# Altium project STM8S003F3P6_Board_Ver1.PrjPcb
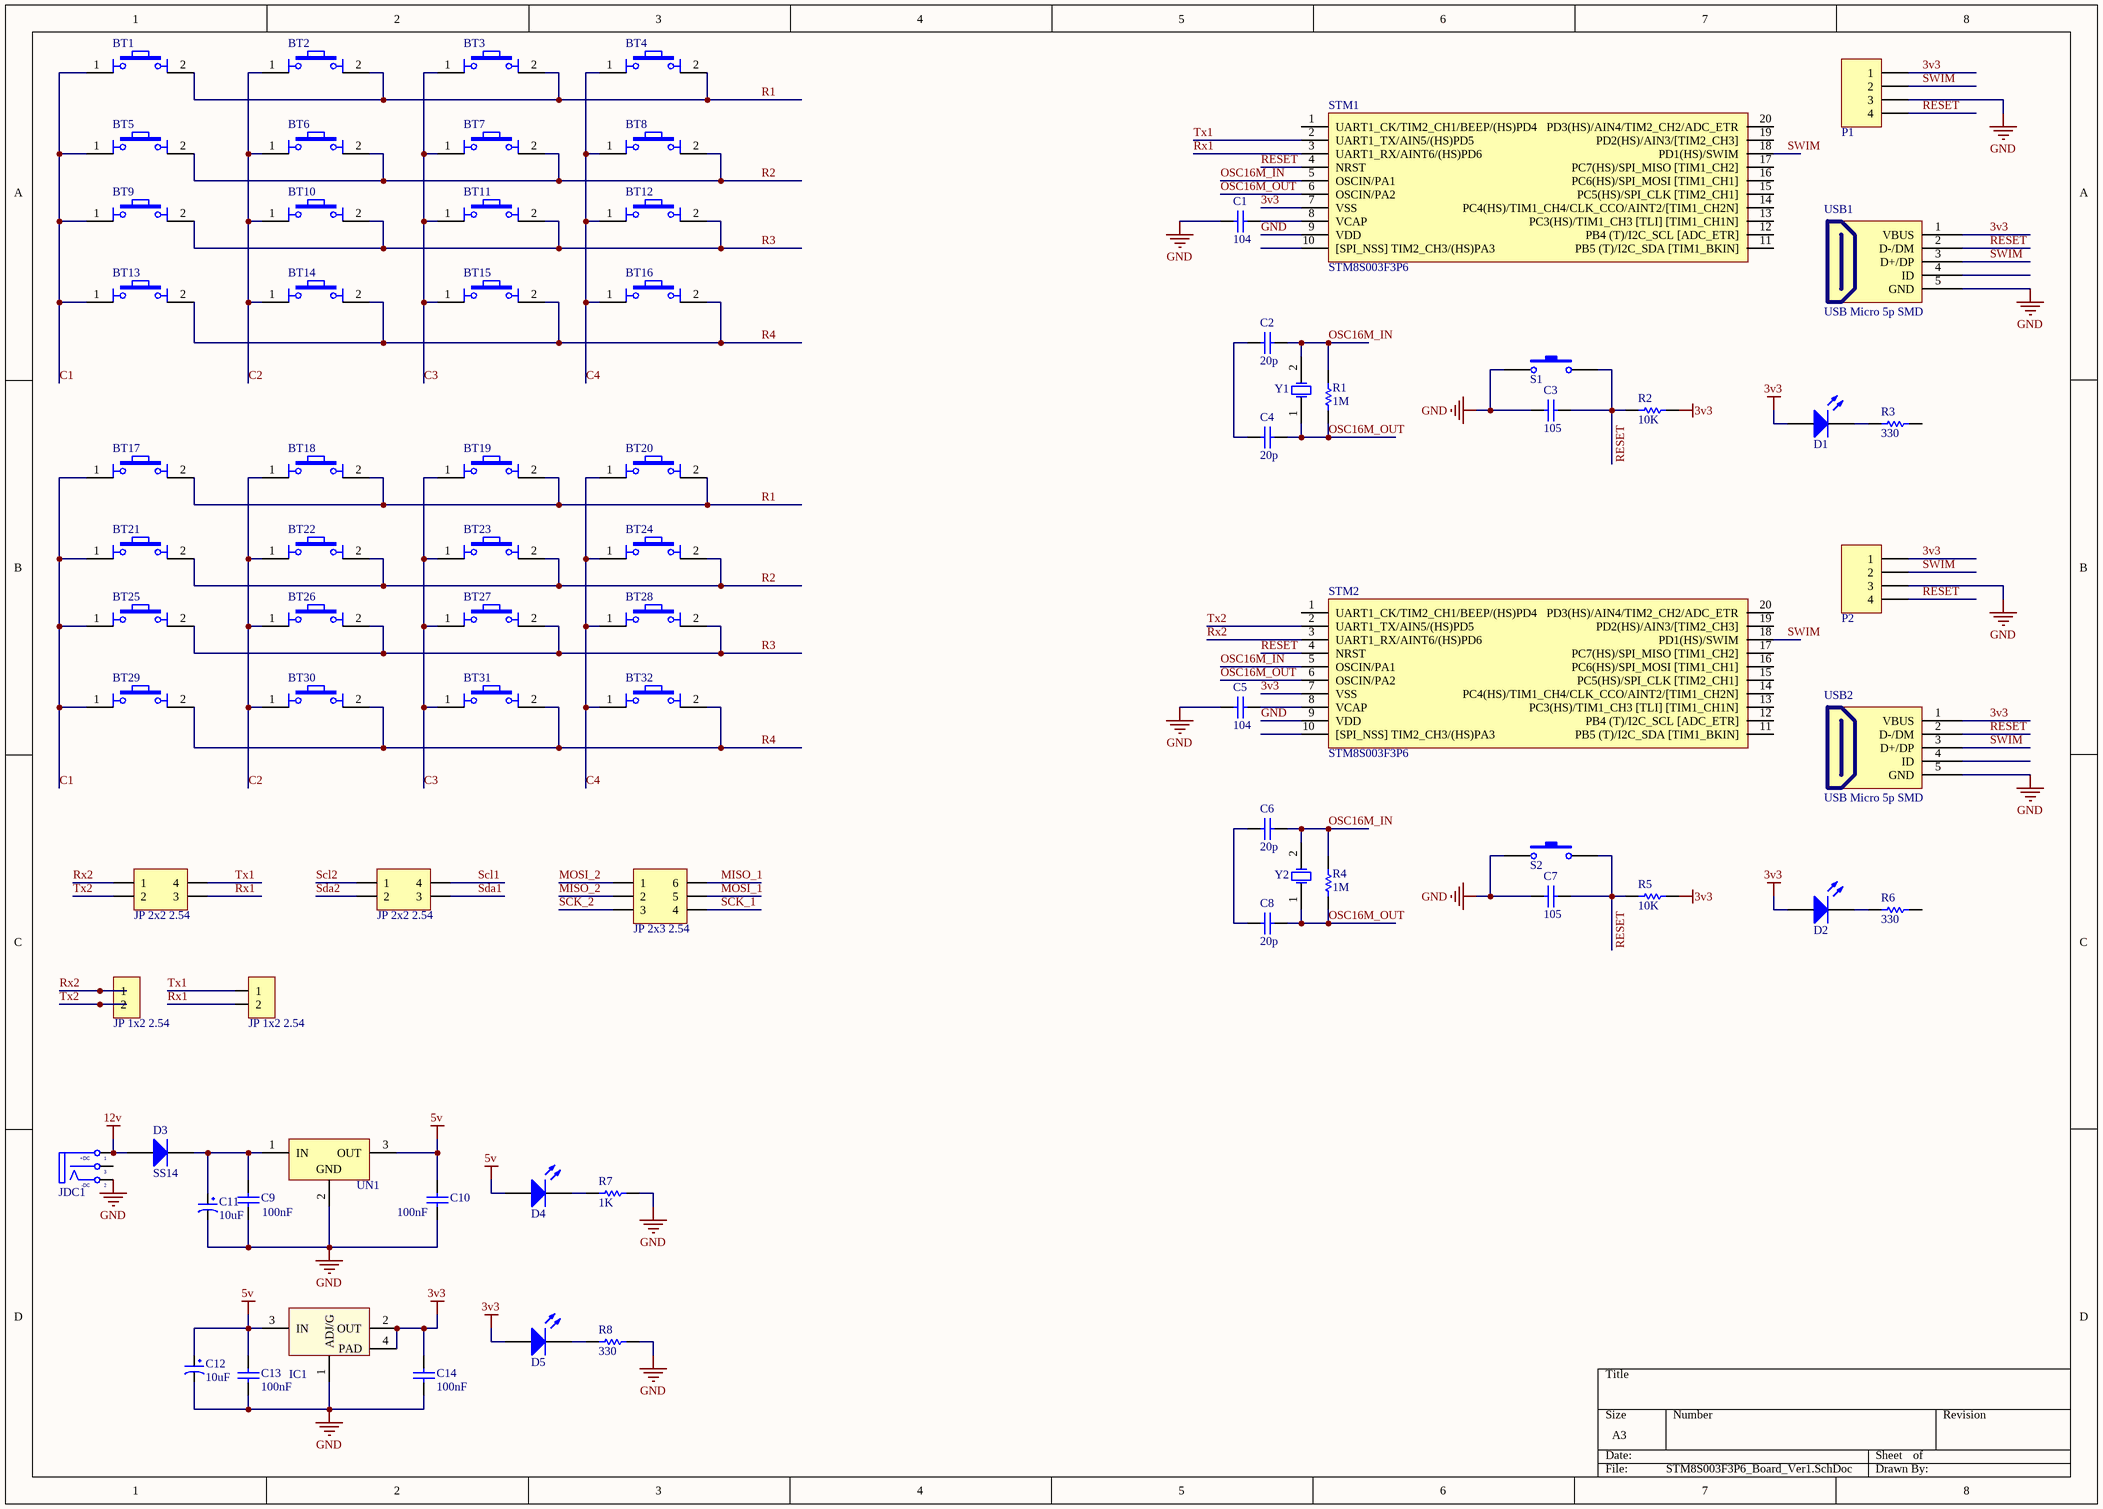
[diagram p0: STM8S003F3P6_Board_Ver1.SchDoc]
1 sheet, 77 parts. Net scope: global (net labels, ports and power ports of the same name join across sheets).
Board file: STM8S003F3P6_Board_Ver1.PcbDoc

## Sheet STM8S003F3P6_Board_Ver1.SchDoc
size A3; SheetNumber: 1; SheetTotal: 1

### Parts
BT1  Nut Nhan 4 Chan Cam 6x6  [Nut Nhan 4 Chan Cam 6x6]  (value not drawn)
BT2  Nut Nhan 4 Chan Cam 6x6  [Nut Nhan 4 Chan Cam 6x6]  (value not drawn)
BT3  Nut Nhan 4 Chan Cam 6x6  [Nut Nhan 4 Chan Cam 6x6]  (value not drawn)
BT4  Nut Nhan 4 Chan Cam 6x6  [Nut Nhan 4 Chan Cam 6x6]  (value not drawn)
BT5  Nut Nhan 4 Chan Cam 6x6  [Nut Nhan 4 Chan Cam 6x6]  (value not drawn)
BT6  Nut Nhan 4 Chan Cam 6x6  [Nut Nhan 4 Chan Cam 6x6]  (value not drawn)
BT7  Nut Nhan 4 Chan Cam 6x6  [Nut Nhan 4 Chan Cam 6x6]  (value not drawn)
BT8  Nut Nhan 4 Chan Cam 6x6  [Nut Nhan 4 Chan Cam 6x6]  (value not drawn)
BT9  Nut Nhan 4 Chan Cam 6x6  [Nut Nhan 4 Chan Cam 6x6]  (value not drawn)
BT10  Nut Nhan 4 Chan Cam 6x6  [Nut Nhan 4 Chan Cam 6x6]  (value not drawn)
BT11  Nut Nhan 4 Chan Cam 6x6  [Nut Nhan 4 Chan Cam 6x6]  (value not drawn)
BT12  Nut Nhan 4 Chan Cam 6x6  [Nut Nhan 4 Chan Cam 6x6]  (value not drawn)
BT13  Nut Nhan 4 Chan Cam 6x6  [Nut Nhan 4 Chan Cam 6x6]  (value not drawn)
BT14  Nut Nhan 4 Chan Cam 6x6  [Nut Nhan 4 Chan Cam 6x6]  (value not drawn)
BT15  Nut Nhan 4 Chan Cam 6x6  [Nut Nhan 4 Chan Cam 6x6]  (value not drawn)
BT16  Nut Nhan 4 Chan Cam 6x6  [Nut Nhan 4 Chan Cam 6x6]  (value not drawn)
BT17  Nut Nhan 4 Chan Cam 6x6  [Nut Nhan 4 Chan Cam 6x6]  (value not drawn)
BT18  Nut Nhan 4 Chan Cam 6x6  [Nut Nhan 4 Chan Cam 6x6]  (value not drawn)
BT19  Nut Nhan 4 Chan Cam 6x6  [Nut Nhan 4 Chan Cam 6x6]  (value not drawn)
BT20  Nut Nhan 4 Chan Cam 6x6  [Nut Nhan 4 Chan Cam 6x6]  (value not drawn)
BT21  Nut Nhan 4 Chan Cam 6x6  [Nut Nhan 4 Chan Cam 6x6]  (value not drawn)
BT22  Nut Nhan 4 Chan Cam 6x6  [Nut Nhan 4 Chan Cam 6x6]  (value not drawn)
BT23  Nut Nhan 4 Chan Cam 6x6  [Nut Nhan 4 Chan Cam 6x6]  (value not drawn)
BT24  Nut Nhan 4 Chan Cam 6x6  [Nut Nhan 4 Chan Cam 6x6]  (value not drawn)
BT25  Nut Nhan 4 Chan Cam 6x6  [Nut Nhan 4 Chan Cam 6x6]  (value not drawn)
BT26  Nut Nhan 4 Chan Cam 6x6  [Nut Nhan 4 Chan Cam 6x6]  (value not drawn)
BT27  Nut Nhan 4 Chan Cam 6x6  [Nut Nhan 4 Chan Cam 6x6]  (value not drawn)
BT28  Nut Nhan 4 Chan Cam 6x6  [Nut Nhan 4 Chan Cam 6x6]  (value not drawn)
BT29  Nut Nhan 4 Chan Cam 6x6  [Nut Nhan 4 Chan Cam 6x6]  (value not drawn)
BT30  Nut Nhan 4 Chan Cam 6x6  [Nut Nhan 4 Chan Cam 6x6]  (value not drawn)
BT31  Nut Nhan 4 Chan Cam 6x6  [Nut Nhan 4 Chan Cam 6x6]  (value not drawn)
BT32  Nut Nhan 4 Chan Cam 6x6  [Nut Nhan 4 Chan Cam 6x6]  (value not drawn)
C1  104  [tu 0805]
C2  value 20p  [CAP-SM-0805]  (hidden comment: Cap Non-Pol SMD)
C3  value 105  [CAP-SM-0805]  (hidden comment: Cap Non-Pol SMD)
C4  value 20p  [CAP-SM-0805]  (hidden comment: Cap Non-Pol SMD)
C5  104  [tu 0805]
C6  value 20p  [CAP-SM-0805]  (hidden comment: Cap Non-Pol SMD)
C7  value 105  [CAP-SM-0805]  (hidden comment: Cap Non-Pol SMD)
C8  value 20p  [CAP-SM-0805]  (hidden comment: Cap Non-Pol SMD)
C9  value 100nF  [CAP-SM-0805]  (hidden comment: Cap Non-Pol SMD)
C10  value 100nF  [CAP-SM-0805]  (hidden comment: Cap Non-Pol SMD)
C11  10uF  [tu tantalum smd3216]
C12  10uF  [tu tantalum smd3216]
C13  value 100nF  [CAP-SM-0805]  (hidden comment: Cap Non-Pol SMD)
C14  value 100nF  [CAP-SM-0805]  (hidden comment: Cap Non-Pol SMD)
D1  LED SMD  [LED_0805_Blue]  (value not drawn)
D2  LED SMD  [LED_0805_Blue]  (value not drawn)
D3  SS14  [DIODE SMA]
D4  LED SMD  [LED_0805_Blue]  (value not drawn)
D5  LED SMD  [LED_0805_Blue]  (value not drawn)
IC1  LM1117  [SOT223-4N]  (value not drawn)
JDC1  Jack DC  [DC-IN]  (value not drawn)
JP1  JP 2x3 2.54  [JP 2x3 DT]
JP2  JP 2x2 2.54  [JP 2x2 DT]
JP3  JP 2x2 2.54  [JP 2x2 DT]
JP4  JP 1x2 2.54  [JP 1x2 DT]
JP5  JP 1x2 2.54  [JP 1x2 DT]
P1  Header 4  [JP4]  (value not drawn)
P2  Header 4  [JP4]  (value not drawn)
R1  value 1M  [RES-SM-0805]  (hidden comment: RESISTOR SMD)
R2  value 10K  [RES-SM-0805]  (hidden comment: RESISTOR SMD)
R3  value 330  [RES-SM-0805]  (hidden comment: RESISTOR SMD)
R4  value 1M  [RES-SM-0805]  (hidden comment: RESISTOR SMD)
R5  value 10K  [RES-SM-0805]  (hidden comment: RESISTOR SMD)
R6  value 330  [RES-SM-0805]  (hidden comment: RESISTOR SMD)
R7  value 1K  [RES-SM-0805]  (hidden comment: RESISTOR SMD)
R8  value 330  [RES-SM-0805]  (hidden comment: RESISTOR SMD)
S1  Tact SW - 2Pin  [SW-SMD]  (value not drawn)
S2  Tact SW - 2Pin  [SW-SMD]  (value not drawn)
STM1  STM8S003F3P6  [TSSOP20]
STM2  STM8S003F3P6  [TSSOP20]
UN1  LM7805  [QTO-220]  (value not drawn)
USB1  USB Micro 5p SMD  [USB Micro 5p SMD]
USB2  USB Micro 5p SMD  [USB Micro 5p SMD]
Y1  XTAL  [XT2]  (value not drawn)
Y2  XTAL  [XT2]  (value not drawn)

### Nets
3v3: C14.2 D1.1(A) D2.1(A) D5.1(A) IC1.2(OUT) IC1.4(PAD) P1.1 P2.1 R2.2 R5.2 STM1.7(VSS) STM2.7(VSS) USB1.1(VBUS) USB2.1(VBUS)
5v: C10.2 C12.1 C13.2 D4.1(A) IC1.3(IN) UN1.3(OUT)
12v: D3.1(A) JDC1.1(T)
GND: C1.2 C3.1 C5.2 C7.1 C9.1 C10.1 C11.2 C12.2 C13.1 C14.1 IC1.1(ADJ/G) JDC1.2(TN) P1.3 P2.3 R7.2 R8.2 S1.1 S2.1 STM1.9(VDD) STM2.9(VDD) UN1.2(GND) USB1.5(GND) USB2.5(GND)
C1: BT1.1 BT5.1 BT9.1 BT13.1 BT17.1 BT21.1 BT25.1 BT29.1
C2: BT2.1 BT6.1 BT10.1 BT14.1 BT18.1 BT22.1 BT26.1 BT30.1
C3: BT3.1 BT7.1 BT11.1 BT15.1 BT19.1 BT23.1 BT27.1 BT31.1
C4: BT4.1 BT8.1 BT12.1 BT16.1 BT20.1 BT24.1 BT28.1 BT32.1
MISO_1: JP1.6
MISO_2: JP1.2
MOSI_1: JP1.5
MOSI_2: JP1.1
OSC16M_IN: C2.2 C6.2 R1.2 R4.2 STM1.5(OSCIN/PA1) STM2.5(OSCIN/PA1) Y1.2(OSC2) Y2.2(OSC2)
OSC16M_OUT: C4.2 C8.2 R1.1 R4.1 STM1.6(OSCIN/PA2) STM2.6(OSCIN/PA2) Y1.1(OSC1) Y2.1(OSC1)
R1: BT1.2 BT2.2 BT3.2 BT4.2 BT17.2 BT18.2 BT19.2 BT20.2
R2: BT5.2 BT6.2 BT7.2 BT8.2 BT21.2 BT22.2 BT23.2 BT24.2
R3: BT9.2 BT10.2 BT11.2 BT12.2 BT25.2 BT26.2 BT27.2 BT28.2
R4: BT13.2 BT14.2 BT15.2 BT16.2 BT29.2 BT30.2 BT31.2 BT32.2
RESET: C3.2 C7.2 P1.4 P2.4 R2.1 R5.1 S1.2 S2.2 STM1.4(NRST) STM2.4(NRST) USB1.2(D-/DM) USB2.2(D-/DM)
Rx1: JP2.3 JP5.2 STM1.3(UART1_RX/AINT6/(HS)PD6)
Rx2: JP2.1 JP4.1 STM2.3(UART1_RX/AINT6/(HS)PD6)
SCK_1: JP1.4
SCK_2: JP1.3
Scl1: JP3.4
Scl2: JP3.1
Sda1: JP3.3
Sda2: JP3.2
SWIM: P1.2 P2.2 STM1.18(PD1(HS)/SWIM) STM2.18(PD1(HS)/SWIM) USB1.3(D+/DP) USB2.3(D+/DP)
Tx1: JP2.4 JP5.1 STM1.2(UART1_TX/AIN5/(HS)PD5)
Tx2: JP2.2 JP4.2 STM2.2(UART1_TX/AIN5/(HS)PD5)
NetC1_1: C1.1 STM1.8(VCAP)
NetC2_1: C2.1 C4.1
NetC5_1: C5.1 STM2.8(VCAP)
NetC6_1: C6.1 C8.1
NetC9_2: C9.2 C11.1 D3.2(K) UN1.1(IN)
NetD1_2: D1.2(K) R3.1
NetD2_2: D2.2(K) R6.1
NetD4_2: D4.2(K) R7.1
NetD5_2: D5.2(K) R8.1

Not connected (* = marked no-connect by the designer): JDC1 3(S); R3 2; R6 2; STM1 1(UART1_CK/TIM2_CH1/BEEP/(HS)PD4) 10([SPI_NSS]_TIM2_CH3/(HS)PA3) 11(PB5_(T)/I2C_SDA_[TIM1_BKIN]) 12(PB4_(T)/I2C_SCL_[ADC_ETR]) 13(PC3(HS)/TIM1_CH3_[TLI]_[TIM1_CH1N]) 14(PC4(HS)/TIM1_CH4/CLK_CCO/AINT2/[TIM1_CH2N]) 15(PC5(HS)/SPI_CLK_[TIM2_CH1]) 16(PC6(HS)/SPI_MOSI_[TIM1_CH1]) 17(PC7(HS)/SPI_MISO_[TIM1_CH2]) 19(PD2(HS)/AIN3/[TIM2_CH3]) 20(PD3(HS)/AIN4/TIM2_CH2/ADC_ETR); STM2 1(UART1_CK/TIM2_CH1/BEEP/(HS)PD4) 10([SPI_NSS]_TIM2_CH3/(HS)PA3) 11(PB5_(T)/I2C_SDA_[TIM1_BKIN]) 12(PB4_(T)/I2C_SCL_[ADC_ETR]) 13(PC3(HS)/TIM1_CH3_[TLI]_[TIM1_CH1N]) 14(PC4(HS)/TIM1_CH4/CLK_CCO/AINT2/[TIM1_CH2N]) 15(PC5(HS)/SPI_CLK_[TIM2_CH1]) 16(PC6(HS)/SPI_MOSI_[TIM1_CH1]) 17(PC7(HS)/SPI_MISO_[TIM1_CH2]) 19(PD2(HS)/AIN3/[TIM2_CH3]) 20(PD3(HS)/AIN4/TIM2_CH2/ADC_ETR); USB1 4(ID); USB2 4(ID)

### Notes on the sheet
- (in symbol Jack DC) +DC; -DC

### Library data of the parts
BT1-BT32 = Nut Nhan 4 Chan Cam 6x6: Nut Nhan 4 Chan 6x6mm; Ten: Nút Nhấn 4 Chân 6x6x5MM DIP; Ma_Hang: MH004584
C1 C5 = Tu 0805 104 50V 10%: Dán; Don_Vi: Con; So_Chan: 2; Ten_Linh_Kien: Tụ 0805 104-100nF 10% 50V; Ma_Hang: MH004551; Chung_Loai: Dán; Kieu_Chan: *
C2-C4 C6-C10 C13 C14 = Cap Non-Pol SMD: Capacitor
C11 C12 = Tu tantalum 10uF 16V SMD3216: Dán; Don_Vi: Con; So_Chan: 2; Ten_Linh_Kien: Tụ tantalum 106C-10uF 16V SMD3216; Ma_Hang: MH001954; Chung_Loai: Dán; Kieu_Chan: *
D1 D2 D4 D5 = LED SMD: LED
D3 = Diode SS14 ( 1N5819): Dán; Ma_Hang: MH002211; Don_Vi: Con; Ten_Linh_Kien: Diode SS14 DO214 Schottky 1A 40V ( 1N5819 DO214); Chung_Loai: Dán; Ghi_Chu: *; Kieu_Chan: *
IC1 = LM1117: Available in 1.8V, 2.5V, 2.85V, 3.3V, 5V, and  Adjustable Versions; Value: LM317
JDC1 = Jack DC: Jack DC input; Value: Jac DC
JP1 = JP 2x3 2.54 Duc Thang: Cắm; Ten_Linh_Kien: Jump Đôi Đực 2.54MM 2x40P Thẳng 11MM; Don_Vi: Con; Ma_Hang: MH002686; Ghi_Chu: *; Kieu_Chan: *; Chung_Loai: Cắm
JP2 JP3 = JP 2x2 2.54 Duc Thang: Cắm; Ten_Linh_Kien: Jump Đôi Đực 2.54MM 2x40P Thẳng 11MM; Don_Vi: Con; Ma_Hang: MH002686; Ghi_Chu: *; Kieu_Chan: *; Chung_Loai: Cắm
JP4 JP5 = JP 1x2 2.54 Duc Thang: Cắm; Ten_Linh_Kien: Jump Đơn Đực 2.54MM 1x40P Thẳng 11MM; Don_Vi: Con; Ma_Hang: MH000903; Ghi_Chu: *; Kieu_Chan: *; Chung_Loai: Cắm
P1 P2 = Header 4: Header, 4-Pin; LatestRevisionDate: 17-Jul-2002; LatestRevisionNote: Re-released for DXP Platform.; Publisher: Altium Limited
R1-R8 = RESISTOR SMD: Resistor
S1 S2 = Tact SW - 2Pin: Switch button 2 pin
STM1 STM2 = STM8S003F3: Dán; Ten_Linh_Kien: STM8S003F3P6 TSSOP20; Don_Vi: Con; Ma_Hang: MH001918; Kieu_Chan: *; Ghi_Chu: *; Chung_Loai: Dán
UN1 = LM7805: Positive Voltage Regulator
USB1 USB2 = USB Micro 5p SMD: USB Type B; Ten: MicroUSB MK5P SMD; Ma_Hang: MH001020
Y1 Y2 = XTAL: Crystal Oscillator; Published: 8-Jun-2000; LatestRevisionDate: 17-Jul-2002; LatestRevisionNote: Re-released for DXP Platform.; PackageReference: R38; Publisher: Altium Limited; PackageDescription: Crystal, Thru-Hole; 2 Leads; Body 3.1 x 8.2 mm (Dia.xH)